# Altium schematic sheet sch.schdoc
size 297 x 189 mm
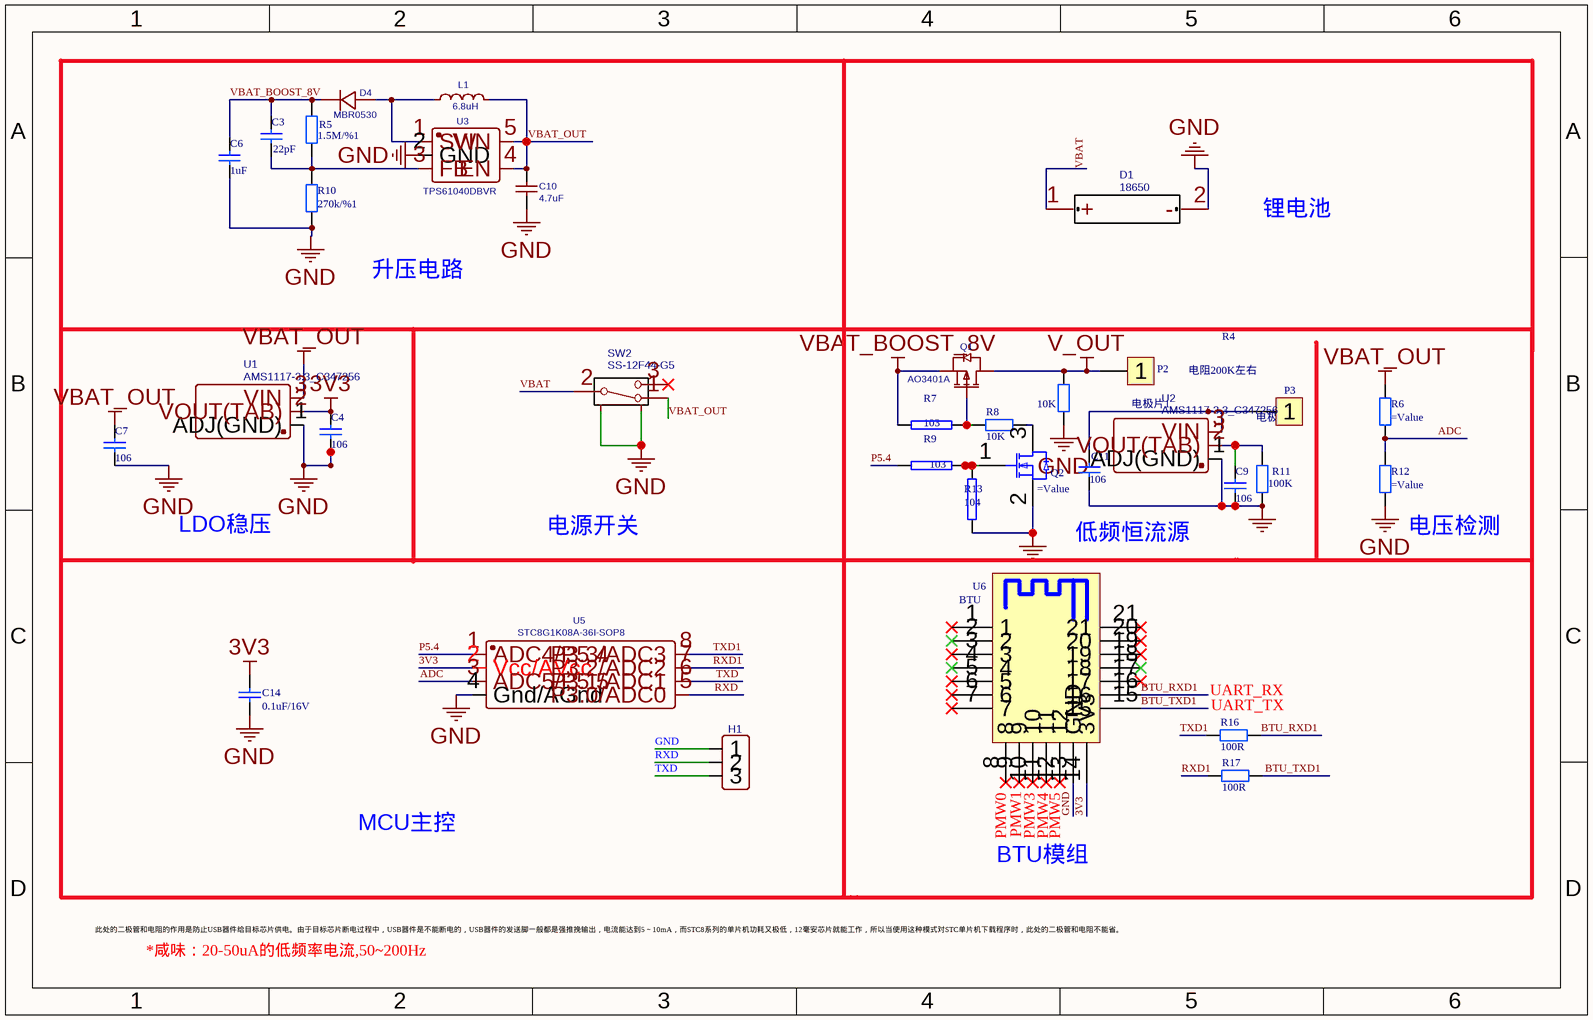
[diagram p0: sch.schdoc]

## Parts
C3  22pF  [C0603]
C4  106  [C0603]
C6  1uF  [C0603]
C7  106  [C0603]
C9  106  [C0603]
C10  4.7uF  [C0603]
C11  106  [C0603]
C14  0.1uF/50V  [C0603]  (value not drawn)
D1  18650  [18650直插]
D4  MBR0530  [MBR0530]
H1  HDR-F-2.54_1x3  [HDR-F-2.54_1X3]  (value not drawn)
L1  6.8uH  [CDRH3D23NP-6R8PC]
P2  CON1  [电极片]  (value not drawn)
P3  CON1  [电极片]  (value not drawn)
Q1  AO3401A  [AO3401A]
Q2  CJ2312  [CJ2312]  (value not drawn)
R4  100K/1%  [R0603]  (value not drawn)
R5  100K/1%  [R0603]  (value not drawn)
R6  100K/1%  [R0603]  (value not drawn)
R7  103  [R0603]
R8  100K/1%  [R0603]  (value not drawn)
R9  103  [R0603_NEW]
R10  100K/1%  [R0603]  (value not drawn)
R11  100K/1%  [R0603]  (value not drawn)
R12  100K/1%  [R0603]  (value not drawn)
R13  104  [R0603]
R16  100R  [R0603_NEW]
R17  100R  [R0603_NEW]
SW2  SS-12F44-G5  [SW-TH_SS-12F44-G5]
U1  AMS1117-3.3_C347256  [SOT-89_L4.5-W2.5-P1.50-LS4.2-BR]
U2  AMS1117-3.3_C347256  [SOT-89_L4.5-W2.5-P1.50-LS4.2-BR]
U3  TPS61040DBVR  [TPS61040DBVR]
U5  STC8G1K08A-36I-SOP8  [STC8G1K08A-36I-SOP8]
U6  CBU  [CBU1]  (value not drawn)

## Nets
3V3: C4.1 C14.2 U1.2(VOUT(TAB)) U5.2(Vcc/AVcc) U6.14(3V3)
GND: C4.2 C6.2 C7.2 C9.2 C10.1 C11.2 C14.1 D1.2(-) H1.1 Q2.2(S) R4.2 R10.1 R11.1 R12.1 R13.1 SW2.4 SW2.5 U1.1(ADJ(GND)) U2.1(ADJ(GND)) U3.2(GND) U5.4(Gnd/AGnd) U6.13(GND)
V_OUT: P2.1 Q1.3(D) R4.1
VBAT_BOOST_8V: C3.1 C6.1 D4.1(K) Q1.2(S) R5.2 R7.1
VBAT_OUT: C7.1 C10.2 L1.2 R6.2 SW2.1 U1.3(VIN) U3.4(EN) U3.5(VIN)
ADC: R6.1 R12.2 U5.3(ADC5/P5.5)
BTU_RXD1: R16.1 U6.16
BTU_TXD1: R17.1 U6.15
P5.4: R9.1 U5.1(ADC4/P5.4)
RXD: H1.2 U5.5(P3.0/ADC0)
RXD1: R17.2 U5.7(P3.2/ADC2)
TXD: H1.3 U5.6(P3.1/ADC1)
TXD1: R16.2 U5.8(P3.3/ADC3)
VBAT: D1.1(+) SW2.2
NetC3_2: C3.2 R5.1 R10.2 U3.3(FB)
NetC9_1: C9.1 R11.2 U2.2(VOUT(TAB))
NetC11_1: C11.1 P3.1 U2.3(VIN)
NetD4_2: D4.2(A) L1.1 U3.1(SW)
NetQ1_1: Q1.1(G) R7.2 R8.1
NetQ2_1: Q2.1(G) R9.2 R13.2
NetQ2_3: Q2.3(D) R8.2

Not connected (* = marked no-connect by the designer): SW2 3*; U6 1* 2* 3* 4* 5* 6* 7* 8* 9* 10* 11* 12* 17* 18* 19* 20* 21*

## Notes on the sheet
- 锂电池
- 升压电路
- (near P2) 电极片1
- 电阻200K左右
- (near P3) 电极片2
- LDO稳压
- 电源开关
- 低频恒流源
- (near R12) 电压检测
- (near R16) UART_RX
- (near R16) UART_TX
- MCU主控
- PMW0
- PMW1
- PMW3
- PMW4
- PMW5
- BTU模组
- 此处的二极管和电阻的作用是防止USB器件给目标芯片供电。由于目标芯片断电过程中，USB器件是不能断电的，USB器件的发送脚一般都是强推挽输出，电流能达到5～10mA，而STC8系列的单片机功耗又极低，12毫安芯片就能工作，所以当使用这种模式对STC单片机下载程序时，此处的二极管和电阻不能省。
- *咸味：20-50uA的低频率电流,50~200Hz
- (in symbol 0.1uF/50V) 0.1uF/16V
- (in symbol 100K/1%) 1.5M/%1; 270k/%1; 100K; 10K
- (in symbol CBU) BTU

## Library data of the parts
C3 = 22pF: Part Number: 1.02.05.00869; BOM_Supplier: LCSC
C4 C7 C9 C11 = 106: Part Number: 1.02.05.00869
C6 = 1uF: Part Number: 1.02.05.00869
C10 = 4.7uF: BOM_Manufacturer: TAIYO YUDEN; BOM_Manufacturer Part: JMK212BJ475KG-T; nameAlias: Capacitance; BOM_Supplier: LCSC; BOM_Supplier Part: C92788; spicePre: C; spiceSymbolName: JMK212BJ475KG-T
C14 = 0.1uF/50V: Part Number: 1.02.05.00834; 物料通用性等级: 高; 工作温度: null; 物料描述: 瓷介电容;贴片;X7R;0.1UF;±10%;50V;0603; 制造商: 华科; 制造商型号: 0603B104K500CT; Orcad Library: C; Orcad Library Path: Z:\tuya_lib\sch-lib\DISCRETE.OLB; Orcad Footprint: c0603,c0603a; Orcad Footprint Path: Z:\tuya_lib\footprint; 管脚数量: 2; 安装方式: 贴片; 物料类目: 瓷介电容; 物料状态: 已发布; 修改人: system; 物料生产状态: 量产; ComponentLink2Description: null; ComponentLink2URL: null; 器件高度: null; 更新时间: 2021-03-25 10:51:02; ALT_SYMBOLS: c0603,c0603a
D1 = 18650: BOM_Manufacturer Part: PIN4; Contributor: tell668; spicePre: D; spiceSymbolName: 18650
D4 = MBR0530: BOM_Manufacturer: Shikues; Contributor: LCSC; BOM_Supplier: LCSC; BOM_Supplier Part: C475718; BOM_Manufacturer Part: MBR0530; BOM_JLCPCB Part Class: Extended Part; spicePre: D; spiceSymbolName: MBR0530_C475718
H1 = HDR-F-2.54_1x3: Contributor: LCEDA_Lib; BOM_Supplier Part: C146690; BOM_Supplier: LCSC; spicePre: H; spiceSymbolName: HDR-F-2.54_1x3
L1 = 6.8uH: BOM_Manufacturer: Sumida; nameAlias: Inductance; Contributor: LCSC; BOM_Supplier: LCSC; BOM_Supplier Part: C323532; BOM_Manufacturer Part: CDRH3D23NP-6R8PC; spicePre: L; spiceSymbolName: CDRH3D23NP-6R8PC
Q1 = AO3401A: BOM_Manufacturer: HUASHUO(华朔); Contributor: LCSC; BOM_Supplier: LCSC; BOM_Supplier Part: C700954; BOM_Manufacturer Part: AO3401A; BOM_JLCPCB Part Class: Extended Part; spicePre: Q; spiceSymbolName: AO3401A_C700954
Q2 = CJ2312: Part Number: 1.06.11.00008; 物料通用性等级: 高; 工作温度: null; 物料描述: 场效应管;N沟道;CJ2312;20V;5A;31.8MR/4.5V;SOT-23;贴片; 制造商: 江苏长电; Orcad Library: FETN_GSD; Orcad Library Path: ‪Z:\tuya_lib\sch-lib\DISCRETE.OLB; Orcad Footprint: sot23-3; Orcad Footprint Path: Z:\tuya_lib\footprint; 管脚数量: 3; 器件高度: 1.15mm; 安装方式: 贴片; 物料类目: 场效应管; 物料状态: 已发布; 修改人: system; 物料生产状态: 量产; ComponentLink2Description: CJ2312.pdf; ComponentLink2URL: file:///\\172.16.246.8\lib-ad\DBlib\Datasheet\三极管资料\CJ2312.pdf; 制造商型号: CJ2312; 更新时间: 2021-03-25 10:51:02
R16 R17 = 100R: Part Number: 1.01.01.00808
SW2 = SS-12F44-G5: BOM_Manufacturer: Rectangular Connectors - Contacts; Contributor: LCSC; BOM_Supplier: LCSC; BOM_Supplier Part: C136718; BOM_Manufacturer Part: SS-12F44-G5; BOM_JLCPCB Part Class: Extended Part; spicePre: S; spiceSymbolName: SS-12F44-G5
U1 U2 = AMS1117-3.3_C347256: BOM_Manufacturer: Youtai Semiconductor Co., Ltd.; Contributor: LCSC; BOM_Supplier: LCSC; BOM_Supplier Part: C347256; BOM_Manufacturer Part: AMS1117-3.3; BOM_JLCPCB Part Class: Extended Part; spicePre: U; spiceSymbolName: AMS1117-3.3_C347256
U3 = TPS61040DBVR: BOM_Manufacturer: TI; BOM_Supplier: LCSC; BOM_Manufacturer Part: TPS61040DBVR; BOM_Supplier Part: C7722; BOM_JLCPCB Part Class: Basic Part; spicePre: U; spiceSymbolName: TPS61040DBVR
U5 = STC8G1K08A-36I-SOP8: BOM_Manufacturer: STC Micro; Contributor: LCSC; BOM_Supplier: LCSC; BOM_Supplier Part: C915663; BOM_Manufacturer Part: STC8G1K08A-36I-SOP8; BOM_JLCPCB Part Class: Extended Part; spicePre: U; spiceSymbolName: STC8G1K08A-36I-SOP8
U6 = CBU: Part Number: 0110; 制造商: 涂鸦; Process: 贴片; Component Type: Standard; 描述: CBU; 制造商型号: CBU; Pin Count: 21